# EAGLE design Ebook_Anita_Ghita (EAGLE 9.7.0)
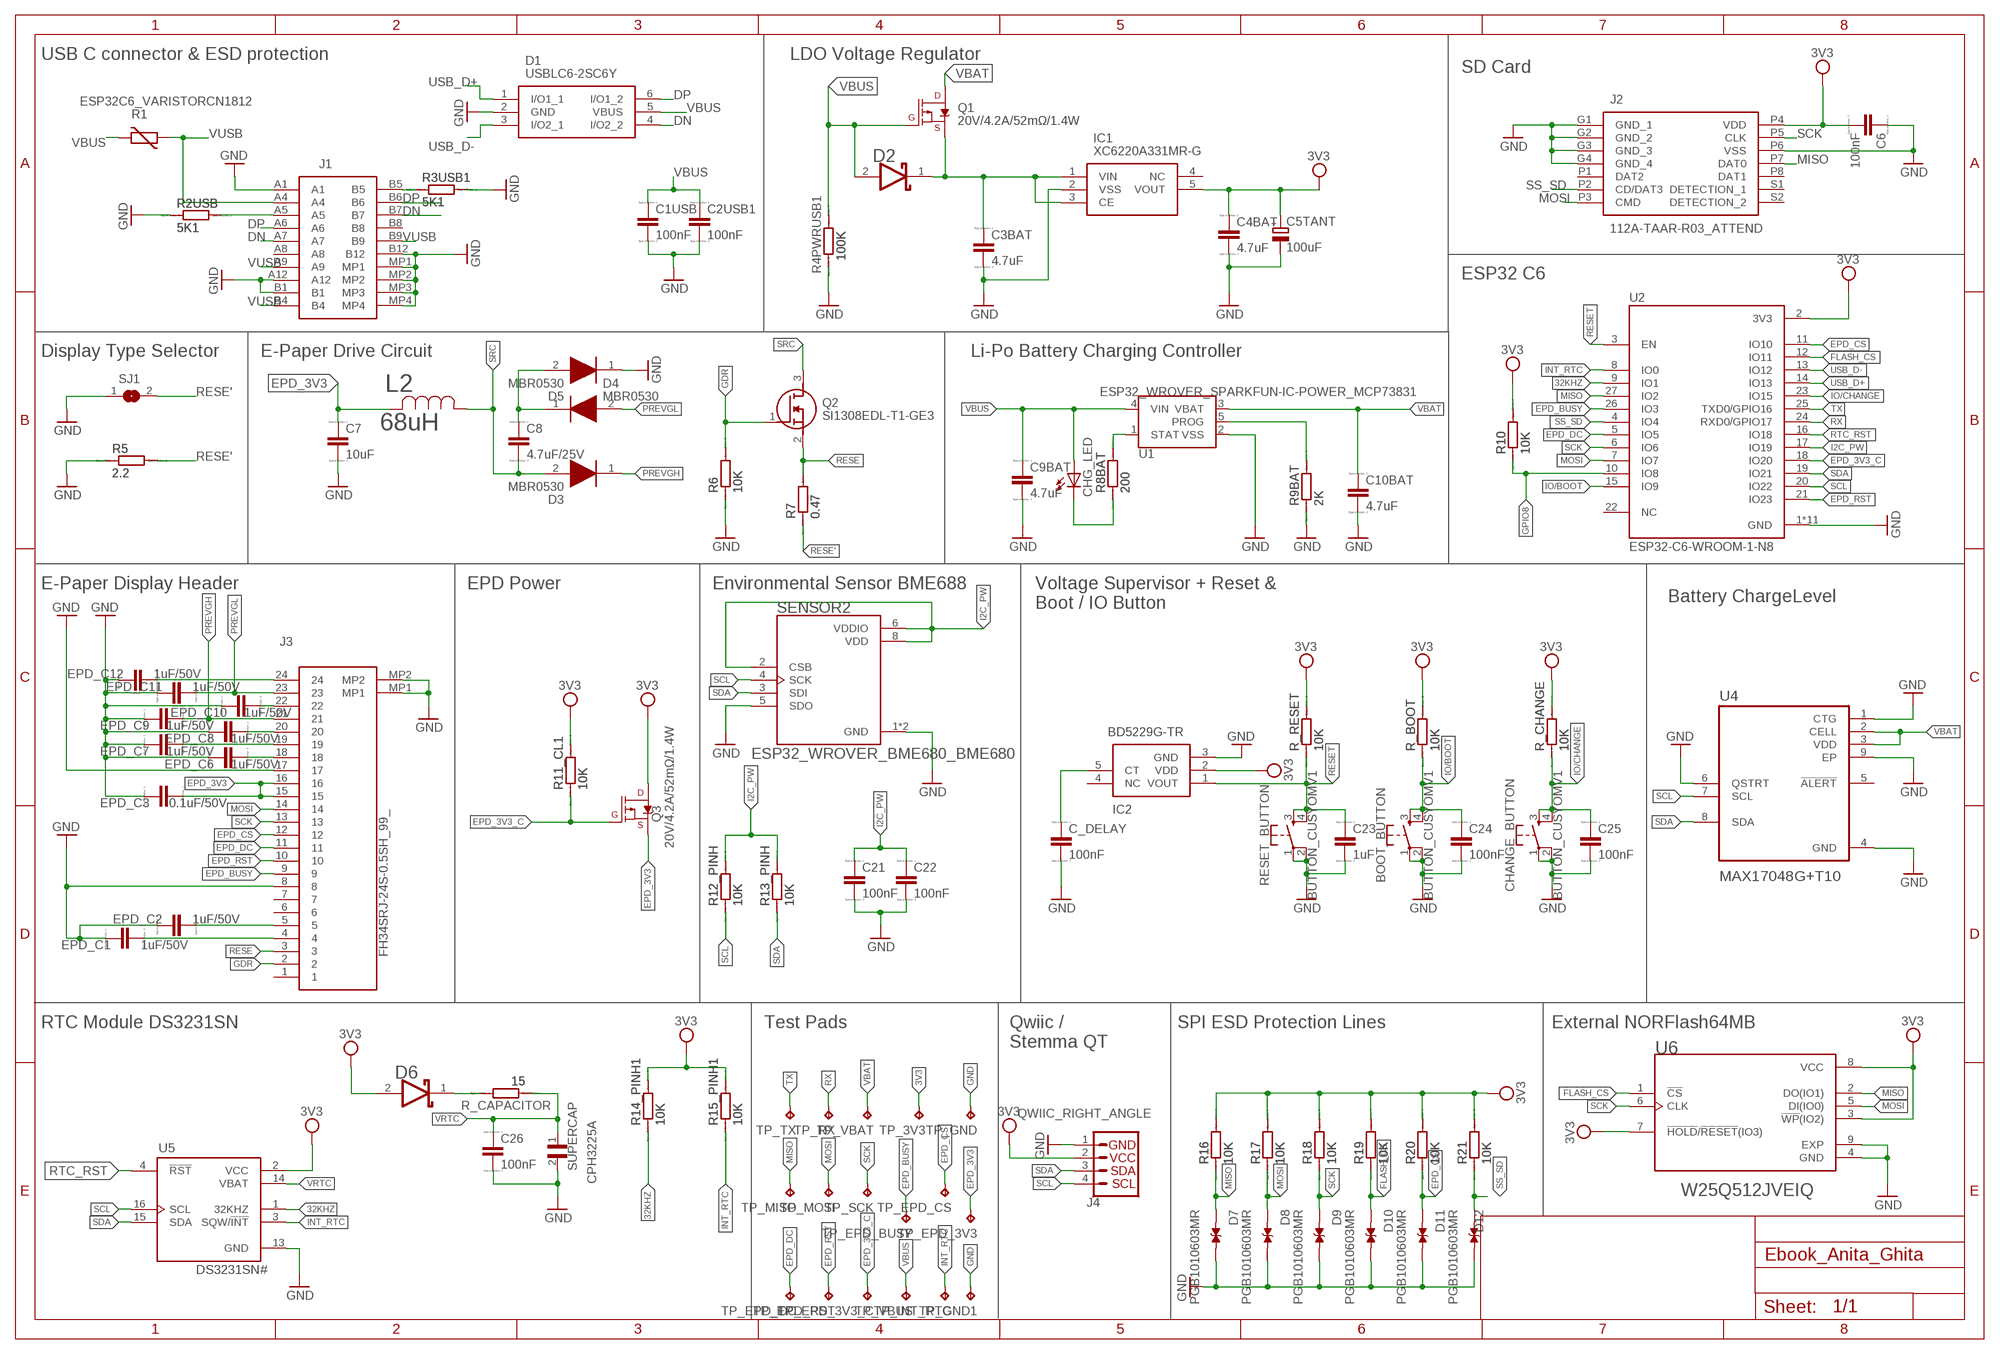
[diagram p0: schematic, sheet 1]

## Parts
BOOT_BUTTON  BUTTON_CUSYOMV1  [MYBUTTON]
C1USB  100nF  EAGLE-LTSPICE_CC0402  [ESP32_WROVER_EAGLE-LTSPICE_C0402]
C2USB1  100nF  EAGLE-LTSPICE_CC0402  [ESP32_WROVER_EAGLE-LTSPICE_C0402]
C3BAT  4.7uF  EAGLE-LTSPICE_CC0402  [ESP32_WROVER_EAGLE-LTSPICE_C0402]
C4BAT  4.7uF  EAGLE-LTSPICE_CC0402  [ESP32_WROVER_EAGLE-LTSPICE_C0402]
C5TANT  100uF  RCL_CPOL-EUCT3528  [RCL_CT3528]
C6  100nF  EAGLE-LTSPICE_CC0402  [ESP32_WROVER_EAGLE-LTSPICE_C0402]
C7  10uF  EAGLE-LTSPICE_CC0402  [ESP32_WROVER_EAGLE-LTSPICE_C0402]
C8  4.7uF/25V  EAGLE-LTSPICE_CC0402  [ESP32_WROVER_EAGLE-LTSPICE_C0402]
C9BAT  4.7uF  EAGLE-LTSPICE_CC0402  [ESP32_WROVER_EAGLE-LTSPICE_C0402]
C10BAT  4.7uF  EAGLE-LTSPICE_CC0402  [ESP32_WROVER_EAGLE-LTSPICE_C0402]
C21  100nF  EAGLE-LTSPICE_CC0402  [ESP32_WROVER_EAGLE-LTSPICE_C0402]
C22  100nF  EAGLE-LTSPICE_CC0402  [ESP32_WROVER_EAGLE-LTSPICE_C0402]
C23  1uF  EAGLE-LTSPICE_CC0402  [ESP32_WROVER_EAGLE-LTSPICE_C0402]
C24  100nF  EAGLE-LTSPICE_CC0402  [ESP32_WROVER_EAGLE-LTSPICE_C0402]
C25  100nF  EAGLE-LTSPICE_CC0402  [ESP32_WROVER_EAGLE-LTSPICE_C0402]
C26  100nF  EAGLE-LTSPICE_CC0402  [ESP32_WROVER_EAGLE-LTSPICE_C0402]
C_DELAY  100nF  EAGLE-LTSPICE_CC0402  [ESP32_WROVER_EAGLE-LTSPICE_C0402]
CHANGE_BUTTON  BUTTON_CUSYOMV1  [MYBUTTON]
CHG_LED  ADAFRUIT_LEDCHIP-LED0603  [ADAFRUIT_CHIP-LED0603]
D1  USBLC6-2SC6Y  [SOT95P280X145-6N]
D2  ESP32_WROVER_AVX---SD0805S020S1R0_AVX_SD0805S020S1R0_0_0AVX_SD0805S020S1R0_0_0  [ESP32_WROVER_AVX---SD0805S020S1R0_AVX_SD0805S020S1R0_0]
D3  MBR0530  [SOD3716X135N]
D4  MBR0530  [SOD3716X135N]
D5  MBR0530  [SOD3716X135N]
D6  ESP32_WROVER_AVX---SD0805S020S1R0_AVX_SD0805S020S1R0_0_0AVX_SD0805S020S1R0_0_0  [ESP32_WROVER_AVX---SD0805S020S1R0_AVX_SD0805S020S1R0_0]
D7  PGB1010603MR  [DIOC1608X36N]
D8  PGB1010603MR  [DIOC1608X36N]
D9  PGB1010603MR  [DIOC1608X36N]
D10  PGB1010603MR  [DIOC1608X36N]
D11  PGB1010603MR  [DIOC1608X36N]
D12  PGB1010603MR  [DIOC1608X36N]
EPD_C1  1uF/50V  EAGLE-LTSPICE_CC0402  [ESP32_WROVER_EAGLE-LTSPICE_C0402]
EPD_C2  1uF/50V  EAGLE-LTSPICE_CC0402  [ESP32_WROVER_EAGLE-LTSPICE_C0402]
EPD_C3  0.1uF/50V  EAGLE-LTSPICE_CC0402  [ESP32_WROVER_EAGLE-LTSPICE_C0402]
EPD_C6  1uF/50V  EAGLE-LTSPICE_CC0402  [ESP32_WROVER_EAGLE-LTSPICE_C0402]
EPD_C7  1uF/50V  EAGLE-LTSPICE_CC0402  [ESP32_WROVER_EAGLE-LTSPICE_C0402]
EPD_C8  1uF/50V  EAGLE-LTSPICE_CC0402  [ESP32_WROVER_EAGLE-LTSPICE_C0402]
EPD_C9  1uF/50V  EAGLE-LTSPICE_CC0402  [ESP32_WROVER_EAGLE-LTSPICE_C0402]
EPD_C10  1uF/50V  EAGLE-LTSPICE_CC0402  [ESP32_WROVER_EAGLE-LTSPICE_C0402]
EPD_C11  1uF/50V  EAGLE-LTSPICE_CC0402  [ESP32_WROVER_EAGLE-LTSPICE_C0402]
EPD_C12  1uF/50V  EAGLE-LTSPICE_CC0402  [ESP32_WROVER_EAGLE-LTSPICE_C0402]
IC1  XC6220A331MR-G  [SOT95P280X120-5N]
IC2  BD5229G-TR  [SOT95P280X125-5N]
J1  SAMACSYS_PARTS_USB4110-GF-A  [SAMACSYS_PARTS_USB4110GFA]
J2  112A-TAAR-R03_ATTEND  [112ATAARR03ATTEND]
J3  FH34SRJ-24S-0.5SH_99_  [FH34SRJ24S05SH99]
J4  QWIIC_RIGHT_ANGLE  QWIIC_CONNECTORJS-1MM  [JST04_1MM_RA]
L2  68uH  744043680IND_4828-WE-TPC_WRE  [IND_4828-WE-TPC_WRE]
Q1  20V/4.2A/52mΩ/1.4W  ESP32_WROVER_SPARKFUN-DISCRETESEMI_MOSFET_PCH-DMG2305UX-7  [ESP32_WROVER_SPARKFUN-DISCRETESEMI_SOT23-3]
Q2  SI1308EDL-T1-GE3  [SOT65P210X110-3N]
Q3  20V/4.2A/52mΩ/1.4W  ESP32_WROVER_SPARKFUN-DISCRETESEMI_MOSFET_PCH-DMG2305UX-7  [ESP32_WROVER_SPARKFUN-DISCRETESEMI_SOT23-3]
R1  ESP32C6_VARISTORCN1812  [ESP32C6_VARISTOR_CT/CN1812]
R2USB  5K1  ESP32_WROVER_EAGLE-LTSPICE_RR0402  [ESP32_WROVER_EAGLE-LTSPICE_R0402]
R3USB1  5K1  ESP32_WROVER_EAGLE-LTSPICE_RR0402  [ESP32_WROVER_EAGLE-LTSPICE_R0402]
R4PWRUSB1  100K  ESP32_WROVER_EAGLE-LTSPICE_RR0402  [ESP32_WROVER_EAGLE-LTSPICE_R0402]
R5  2.2  ESP32_WROVER_EAGLE-LTSPICE_RR0402  [ESP32_WROVER_EAGLE-LTSPICE_R0402]
R6  10K  ESP32_WROVER_EAGLE-LTSPICE_RR0402  [ESP32_WROVER_EAGLE-LTSPICE_R0402]
R7  0.47  ESP32_WROVER_EAGLE-LTSPICE_RR0402  [ESP32_WROVER_EAGLE-LTSPICE_R0402]
R8BAT  200  ESP32_WROVER_EAGLE-LTSPICE_RR0402  [ESP32_WROVER_EAGLE-LTSPICE_R0402]
R9BAT  2K  ESP32_WROVER_EAGLE-LTSPICE_RR0402  [ESP32_WROVER_EAGLE-LTSPICE_R0402]
R10  10K  ESP32_WROVER_EAGLE-LTSPICE_RR0402  [ESP32_WROVER_EAGLE-LTSPICE_R0402]
R11_CL1  10K  ESP32_WROVER_EAGLE-LTSPICE_RR0402  [ESP32_WROVER_EAGLE-LTSPICE_R0402]
R12_PINH  10K  ESP32_WROVER_EAGLE-LTSPICE_RR0402  [ESP32_WROVER_EAGLE-LTSPICE_R0402]
R13_PINH  10K  ESP32_WROVER_EAGLE-LTSPICE_RR0402  [ESP32_WROVER_EAGLE-LTSPICE_R0402]
R14_PINH1  10K  ESP32_WROVER_EAGLE-LTSPICE_RR0402  [ESP32_WROVER_EAGLE-LTSPICE_R0402]
R15_PINH1  10K  ESP32_WROVER_EAGLE-LTSPICE_RR0402  [ESP32_WROVER_EAGLE-LTSPICE_R0402]
R16  10K  ESP32_WROVER_EAGLE-LTSPICE_RR0402  [ESP32_WROVER_EAGLE-LTSPICE_R0402]
R17  10K  ESP32_WROVER_EAGLE-LTSPICE_RR0402  [ESP32_WROVER_EAGLE-LTSPICE_R0402]
R18  10K  ESP32_WROVER_EAGLE-LTSPICE_RR0402  [ESP32_WROVER_EAGLE-LTSPICE_R0402]
R19  10K  ESP32_WROVER_EAGLE-LTSPICE_RR0402  [ESP32_WROVER_EAGLE-LTSPICE_R0402]
R20  10K  ESP32_WROVER_EAGLE-LTSPICE_RR0402  [ESP32_WROVER_EAGLE-LTSPICE_R0402]
R21  10K  ESP32_WROVER_EAGLE-LTSPICE_RR0402  [ESP32_WROVER_EAGLE-LTSPICE_R0402]
R_BOOT  10K  ESP32_WROVER_EAGLE-LTSPICE_RR0402  [ESP32_WROVER_EAGLE-LTSPICE_R0402]
R_CAPACITOR  15  ESP32_WROVER_EAGLE-LTSPICE_RR0402  [ESP32_WROVER_EAGLE-LTSPICE_R0402]
R_CHANGE  10K  ESP32_WROVER_EAGLE-LTSPICE_RR0402  [ESP32_WROVER_EAGLE-LTSPICE_R0402]
R_RESET  10K  ESP32_WROVER_EAGLE-LTSPICE_RR0402  [ESP32_WROVER_EAGLE-LTSPICE_R0402]
RESET_BUTTON  BUTTON_CUSYOMV1  [MYBUTTON]
SENSOR2  ESP32_WROVER_BME680_BME680  [ESP32_WROVER_BME680_PSON80P300X300X100-8N]
SJ1  SJ  [SJ]
SUPERCAP  CPH3225A  [CAPCP3225X100N]
TP_3V3  TPTP20R  [TP20R]
TP_EPD_3V3  TPTP20R  [TP20R]
TP_EPD_3V3_C  TPTP20R  [TP20R]
TP_EPD_BUSY  TPTP20R  [TP20R]
TP_EPD_CS  TPTP20R  [TP20R]
TP_EPD_DC  TPTP20R  [TP20R]
TP_EPD_RST  TPTP20R  [TP20R]
TP_GND  TPTP20R  [TP20R]
TP_GND1  TPTP20R  [TP20R]
TP_INT_RTC  TPTP20R  [TP20R]
TP_MISO  TPTP20R  [TP20R]
TP_MOSI  TPTP20R  [TP20R]
TP_RX  TPTP20R  [TP20R]
TP_SCK  TPTP20R  [TP20R]
TP_TX  TPTP20R  [TP20R]
TP_VBAT  TPTP20R  [TP20R]
TP_VBUS  TPTP20R  [TP20R]
U1  ESP32_WROVER_SPARKFUN-IC-POWER_MCP73831  [ESP32_WROVER_SPARKFUN-IC-POWER_SOT23-5]
U2  ESP32-C6-WROOM-1-N8  [XCVR_ESP32-C6-WROOM-1-N8]
U4  MAX17048G+T10  [SON50P200X200X80-9N]
U5  DS3231SN#  [SOIC127P1032X265-16N]
U6  W25Q512JVEIQ  [SON127P600X800X80-9N]

## Nets
3V3: C4BAT.1 C5TANT.+ C6.2 D6.2(ANODE) IC1.5(VOUT) IC2.2(VDD) J2.P4(VDD) J4.2 Q3.3(D) R10.2 R11_CL1.2 R14_PINH1.2 R15_PINH1.2 R16.2 R17.2 R18.2 R19.2 R20.2 R21.2 R_BOOT.2 R_CHANGE.2 R_RESET.2 TP_3V3.TP U2.2(3V3) U5.2(VCC) U6.3(!WP!(IO2)) U6.7(!HOLD!/!RESET!(IO3)) U6.8(VCC)
32KHZ: R14_PINH1.1 U2.9(IO1) U5.1(32KHZ)
DN: D1.4(I/O2_2) J1.A7 J1.B7
DP: D1.6(I/O1_2) J1.A6 J1.B6
EPD_3V3: C7.1 EPD_C3.2 J3.15 J3.16 L2.2 Q3.2(S) TP_EPD_3V3.TP
EPD_3V3_C: Q3.1(G) R11_CL1.1 TP_EPD_3V3_C.TP U2.18(IO20)
EPD_BUSY: J3.9 TP_EPD_BUSY.TP U2.26(IO3)
EPD_CS: D11.1 J3.12 R20.1 TP_EPD_CS.TP U2.11(IO10)
EPD_DC: J3.11 TP_EPD_DC.TP U2.5(IO5)
EPD_RST: J3.10 TP_EPD_RST.TP U2.21(IO23)
FLASH_CS: D10.1 R19.1 U2.12(IO11) U6.1(!CS)
GDR: J3.2 Q2.1(G) R6.2
GND: BOOT_BUTTON.1 BOOT_BUTTON.2 C1USB.2 C2USB1.2 C3BAT.2 C4BAT.2 C5TANT.- C6.1 C7.2 C9BAT.2 C10BAT.2 C21.2 C22.2 C23.2 C24.2 C25.2 C26.2 C_DELAY.2 CHANGE_BUTTON.1 CHANGE_BUTTON.2 D1.2(GND) D5.1(K) D7.2 D8.2 D9.2 D10.2 D11.2 D12.2 EPD_C1.1 EPD_C2.1 EPD_C3.1 EPD_C6.1 EPD_C7.1 EPD_C8.1 EPD_C9.1 EPD_C10.1 EPD_C11.1 EPD_C12.1 IC1.2(VSS) IC2.3(GND) J1.A1 J1.A12 J1.B1 J1.B12 J1.MP1 J1.MP2 J1.MP3 J1.MP4 J2.G1(GND_1) J2.G2(GND_2) J2.G3(GND_3) J2.G4(GND_4) J2.P6(VSS) J3.8 J3.17 J3.MP1 J3.MP2 J4.1 R2USB.1 R3USB1.2 R4PWRUSB1.1 R5.1 R6.1 R9BAT.1 RESET_BUTTON.1 RESET_BUTTON.2 SENSOR2.1(GND) SENSOR2.5(SDO) SENSOR2.7(GND) SJ1.1 SUPERCAP.2 TP_GND1.TP TP_GND.TP U1.2(VSS) U2.1(GND) U2.28(GND) U2.29_1(GND) U2.29_2(GND) U2.29_3(GND) U2.29_4(GND) U2.29_5(GND) U2.29_6(GND) U2.29_7(GND) U2.29_8(GND) U2.29_9(GND) U4.1(CTG) U4.4(GND) U4.6(QSTRT) U4.9(EP) U5.13(GND) U6.4(GND) U6.9(EXP)
GPIO8: R10.1 U2.10(IO8)
I2C_PW: C21.1 C22.1 R12_PINH.2 R13_PINH.2 SENSOR2.2(CSB) SENSOR2.6(VDDIO) SENSOR2.8(VDD) U2.17(IO19)
INT_RTC: R15_PINH1.1 TP_INT_RTC.TP U2.8(IO0) U5.3(SQW/!INT)
IO/BOOT: BOOT_BUTTON.3 BOOT_BUTTON.4 C24.1 R_BOOT.1 U2.15(IO9)
IO/CHANGE: C25.1 CHANGE_BUTTON.3 CHANGE_BUTTON.4 R_CHANGE.1 U2.23(IO15)
MISO: D7.1 J2.P7(DAT0) R16.1 TP_MISO.TP U2.27(IO2) U6.2(DO(IO1))
MOSI: D8.1 J2.P3(CMD) J3.14 R17.1 TP_MOSI.TP U2.7(IO7) U6.5(DI(IO0))
N$1: J1.A5 R2USB.2
N$2: EPD_C6.2 J3.18
N$3: EPD_C1.2 J3.4
N$4: C3BAT.1 D2.1(CATHODE) IC1.1(VIN) IC1.3(CE) Q1.2(S)
N$5: C8.1 D4.1(K) D5.2(A)
N$6: R8BAT.2 U1.1(STAT)
N$7: CHG_LED.C R8BAT.1
N$8: R9BAT.2 U1.5(PROG)
N$9: EPD_C2.2 J3.5
N$10: J1.B5 R3USB1.1
N$11: EPD_C7.2 J3.19
N$12: EPD_C8.2 J3.20
N$13: C_DELAY.1 IC2.5(CT)
N$14: EPD_C10.2 J3.22
N$15: D6.1(CATHODE) R_CAPACITOR.2
N$16: EPD_C12.2 J3.24
PREVGH: D3.1(K) EPD_C9.2 J3.21
PREVGL: D4.2(A) EPD_C11.2 J3.23
RESE: J3.3 Q2.2(S) R7.2
RESE': R5.2 R7.1 SJ1.2
RESET: C23.1 IC2.1(VOUT) R_RESET.1 RESET_BUTTON.3 RESET_BUTTON.4 U2.3(EN)
RTC_RST: U2.16(IO18) U5.4(!RST)
RX: TP_RX.TP U2.24(RXD0/GPIO17)
SCK: D9.1 J2.P5(CLK) J3.13 R18.1 TP_SCK.TP U2.6(IO6) U6.6(CLK)
SCL: J4.4 R12_PINH.1 SENSOR2.4(SCK) U2.20(IO22) U4.7(SCL) U5.16(SCL)
SDA: J4.3 R13_PINH.1 SENSOR2.3(SDI) U2.19(IO21) U4.8(SDA) U5.15(SDA)
SRC: C8.2 D3.2(A) L2.1 Q2.3(D)
SS_SD: D12.1 J2.P2(CD/DAT3) R21.1 U2.4(IO4)
TX: TP_TX.TP U2.25(TXD0/GPIO16)
USB_D+: D1.1(I/O1_1) U2.14(IO13)
USB_D-: D1.3(I/O2_1) U2.13(IO12)
VBAT: C10BAT.1 Q1.3(D) TP_VBAT.TP U1.3(VBAT) U4.2(CELL) U4.3(VDD)
VBUS: C1USB.1 C2USB1.1 C9BAT.1 CHG_LED.A D1.5(VBUS) D2.2(ANODE) Q1.1(G) R1.2 R4PWRUSB1.2 TP_VBUS.TP U1.4(VIN)
VRTC: C26.1 R_CAPACITOR.1 SUPERCAP.1 U5.14(VBAT)
VUSB: J1.A4 J1.A9 J1.B4 J1.B9 R1.1
Unconnected: IC1.4(NC) IC2.4(NC) J1.A8 J1.B8 J2.P1(DAT2) J2.P8(DAT1) J2.S1(DETECTION_1) J2.S2(DETECTION_2) J3.1 J3.6 J3.7 U2.22(NC) U4.5(!ALERT)

## Notes on the sheet
- USB C connector & ESD protection | LDO Voltage Regulator
- SD Card
- ESP32 C6
- Display Type Selector | E-Paper Drive Circuit | Li-Po Battery Charging Controller
- E-Paper Display Header | EPD Power | Environmental Sensor BME688
- Voltage Supervisor + Reset &
  Boot / IO Button
- Battery ChargeLevel
- RTC Module DS3231SN | Test Pads
- Qwiic /
  Stemma QT
- SPI ESD Protection Lines | External NORFlash64MB

## Library data of the parts
BOOT_BUTTON CHANGE_BUTTON RESET_BUTTON = DeskAssistant v19 v1:BUTTON_CUSYOMV1
C1USB C2USB1 C3BAT C4BAT C6-C8 C9BAT C10BAT C21-C26 C_DELAY EPD_C1-EPD_C3 EPD_C6-EPD_C12 = DeskAssistant v19 v1:EAGLE-LTSPICE_C: CAPACITOR, European symbol; SPICEMODEL: NONE; SPICEPREFIX: C
C5TANT = DeskAssistant v19 v1:RCL_CPOL-EU: POLARIZED CAPACITOR, European symbol; SPICEPREFIX: C
CHG_LED = DeskAssistant v19 v1:ADAFRUIT_LED: LED OSRAM: - CHIPLED LG R971, LG N971, LY N971, LG Q971, LY Q971, LO R971, LY R971 LH N974, LH R974 LS Q976, LO Q976, LY Q976 LO Q996 - Hyper CHIPLED LW Q18S LB Q993, LB Q99A, LB R99A - SideLED LS A670, LO A670, LY A670, LG A670, LP A670 LB A673, LV A673, LT A673, LW A673 LH A674 LY A675 LS A676, LA A676, LO A676, LY A676, LW A676 LS A679, LY A679, LG A679 - Hyper Micro SIDELED® LS Y876, LA Y876, LO Y876, LY Y876 LT Y87S - SmartLED LW L88C, LW L88S LB L89C, LB L89S, LG L890 LS L89K, LO L89K, LY L89K LS L896, LA L896, LO L896, LY L896 - TOPLED LS T670, LO T670, LY T670, LG T670, LP T670 LSG T670, LSP T670, LSY T670, LOP T670, LYG T670 LG T671, LOG T671, LSG T671 LB T673, LV T673, LT T673, LW T673 LH T674 LS T676, LA T676, LO T676, LY T676, LB T676, LH T676, LSB T676, LW T676 LB T67C, LV T67C, LT T67C, LS T67K, LO T67K, LY T67K, LW E67C LS E67B, LA E67B, LO E67B, LY E67B, LB E67C, LV E67C, LT E67C LW T67C LS T679, LY T679, LG T679 LS T770, LO T770, LY T770, LG T770, LP T770 LB T773, LV T773, LT T773, LW T773 LH T774 LS E675, LA E675, LY E675, LS T675 LS T776, LA T776, LO T776, LY T776, LB T776 LHGB T686 LT T68C, LB T68C - Hyper Mini TOPLED® LB M676 - Mini TOPLED Santana® LG M470 LS M47K, LO M47K, LY M47K Source: http://www.osram.convergy.de/
D1 = DeskAssistant v19 v1:USBLC6-2SC6Y: Low Cap. ESD Protection Auto SOT-23-6 STMicroelectronics USBLC6-2SC6Y, Dual Uni-Directional TVS Diode Array, 6-Pin SOT-23 Source: Datasheet <https://componentsearchengine.com/Datasheets/1/USBLC6-2SC6Y.pdf> Check availability <https://pricing.snapeda.com/parts/USBLC6-2SC6Y/STMicroelectronics/view-part?ref=eda>; AVAILABILITY: In Stock; CHECK_PRICES: https://www.snapeda.com/parts/USBLC6-2SC6Y/STMicroelectronics/view-part/?ref=eda; DESCRIPTION: 17V Clamp 5A (8/20µs) Ipp Tvs Diode Surface Mount SOT-23-6; MF: STMicroelectronics; MP: USBLC6-2SC6Y; PACKAGE: SOT-23-6 STMicroelectronics; PRICE: None; SNAPEDA_LINK: https://www.snapeda.com/parts/USBLC6-2SC6Y/STMicroelectronics/view-part/?ref=snap
D2 D6 = DeskAssistant v19 v1:ESP32_WROVER_AVX---SD0805S020S1R0_AVX_SD0805S020S1R0_0_0: Schottky Barrier Rectifier Diode; CENTROID_NOT_SPECIFIED: No; DATASHEET: http://datasheets.avx.com/schottky.pdf; DIGIKEY_DESCRIPTION: DIODE SCHOTTKY 20V 1A 0805; DIGIKEY_PART_NUMBER: 478-7800-1-ND; LEAD_FREE: yes; MF: AVX; MOUSER_PART_NUMBER: 581-SD0805S020S1R0; PACKAGE: 0805 (2012 metric); PREFIX: D; ROHS: yes; TEMPERATURE_RANGE_HIGH: +125°C; TEMPERATURE_RANGE_LOW: -55°C
D3-D5 = DeskAssistant v19 v1:MBR0530: ON SEMICONDUCTOR - MBR0530 - DIODE, SCHOTTKY, 0.5A, 30V, SOD-123 Source: Datasheet <http://www.onsemi.com/pub/Collateral/MBR0530T1-D.PDF> Check availability <https://pricing.snapeda.com/parts/MBR0530/ON%20Semiconductor/view-part?ref=eda>; AVAILABILITY: In Stock; CHECK_PRICES: https://www.snapeda.com/parts/MBR0530/Onsemi/view-part/?ref=eda; DESCRIPTION: Diode Schottky 30 V 500mA Surface Mount SOD-123; MF: ON Semiconductor; MP: MBR0530; PACKAGE: SOD-123-2 ON Semiconductor; PRICE: None; PURCHASE-URL: https://www.snapeda.com/api/url_track_click_mouser/?unipart_id=179458&manufacturer=ON Semiconductor&part_name=MBR0530&search_term=None; SNAPEDA_LINK: https://www.snapeda.com/parts/MBR0530/Onsemi/view-part/?ref=snap
D7-D12 = DeskAssistant v19 v1:PGB1010603MR: Check availability <https://pricing.snapeda.com/parts/PGB1010603MR/Littelfuse%20Inc./view-part?ref=eda>; AVAILABILITY: In Stock; CHECK_PRICES: https://www.snapeda.com/parts/PGB1010603MR/Littelfuse/view-part/?ref=eda; DESCRIPTION: 150V (Typ) Clamp - Ipp Tvs Diode Surface Mount 0603 (1608 Metric); MF: Littelfuse Inc.; MP: PGB1010603MR; PACKAGE: 0603 Littelfuse Inc.; PRICE: None; PURCHASE-URL: https://www.snapeda.com/api/url_track_click_mouser/?unipart_id=5659453&manufacturer=Littelfuse Inc.&part_name=PGB1010603MR&search_term=None; SNAPEDA_LINK: https://www.snapeda.com/parts/PGB1010603MR/Littelfuse/view-part/?ref=snap
IC1 = DeskAssistant v19 v1:XC6220A331MR-G: LDO Voltage Regulators Source: Datasheet <https://www.torexsemi.com/file/xc6220/XC6220.pdf>; DESCRIPTION: LDO Voltage Regulators; HEIGHT: 1.2mm; MANUFACTURER_NAME: Torex; MANUFACTURER_PART_NUMBER: XC6220A331MR-G; MOUSER_PART_NUMBER: 865-XC6220A331MR-G; MOUSER_PRICE-STOCK: https://www.mouser.co.uk/ProductDetail/Torex-Semiconductor/XC6220A331MR-G?qs=AsjdqWjXhJ8ZSWznL1J0gg%3D%3D
IC2 = DeskAssistant v19 v1:BD5229G-TR: Voltage Detector with Adjustable Delay Time: CMOS processes are utilized to develop high precision, low current consumption CMOS reset ICs that allow arbitrary setting of the delay time. The extensive lineup includes both Nch Open Drain and CMOS output types in a wide range of detection voltages (from 2.3V to 6.0V, in 0.1V steps), enabling selection of the ideal solution based on customer requirements. In addition, the entire series is of course both lead-free and RoHS-compliant. Source: Datasheet <https://datasheet.datasheetarchive.com/originals/distributors/Datasheets_SAMA/f2b9741ef86007909f138d561a359946.pdf>; DESCRIPTION: Voltage Detector with Adjustable Delay Time: CMOS processes are utilized to develop high precision, low current consumption CMOS reset ICs that allow arbitrary setting of the delay time. The extensive lineup includes both Nch Open Drain and CMOS output types in a wide range of detection voltages (from 2.3V to 6.0V, in 0.1V steps), enabling selection of the ideal solution based on customer requirements. In addition, the entire series is of course both lead-free and RoHS-compliant.; HEIGHT: 1.25mm; MANUFACTURER_NAME: ROHM Semiconductor; MANUFACTURER_PART_NUMBER: BD5229G-TR; MOUSER_PART_NUMBER: 755-BD5229G-TR; MOUSER_PRICE-STOCK: https://www.mouser.co.uk/ProductDetail/ROHM-Semiconductor/BD5229G-TR?qs=4kLU8WoGk0vvnhrrYwdszw%3D%3D
J1 = DeskAssistant v19 v1:SAMACSYS_PARTS_USB4110-GF-A: CONN USB 2.0 TYPE-C R/A SMT Source: Datasheet <https://gct.co/files/drawings/usb4110.pdf>; DESCRIPTION: CONN USB 2.0 TYPE-C R/A SMT; HEIGHT: 3.26mm; MANUFACTURER_NAME: GCT (GLOBAL CONNECTOR TECHNOLOGY); MANUFACTURER_PART_NUMBER: USB4110-GF-A; MOUSER_PART_NUMBER: 640-USB4110-GF-A; MOUSER_PRICE-STOCK: https://www.mouser.co.uk/ProductDetail/GCT/USB4110-GF-A?qs=KUoIvG%2F9IlYiZvIXQjyJeA%3D%3D
J2 = DeskAssistant v19 v1:112A-TAAR-R03_ATTEND: Micro SD Card Socket, Push-Push Type, Top Mount, SMT, H=1.83mm, 10u Source: Datasheet <https://www.attend.com.tw/data/download/file/112A-TAAR-R03.pdf>; DESCRIPTION: Micro SD Card Socket, Push-Push Type, Top Mount, SMT, H=1.83mm, 10u; HEIGHT: 1.9mm; MANUFACTURER_NAME: ATTEND; MANUFACTURER_PART_NUMBER: 112A-TAAR-R03 ATTEND
J3 = DeskAssistant v19 v1:FH34SRJ-24S-0.5SH_99_: 24 Position FFC, FPC Connector Contacts, Top and Bottom 0.020" (0.50mm) Surface Mount, Right Angle Source: Datasheet <https://www.hirose.com/en/product/document?clcode=CL0580-1255-6-99&productname=FH34SRJ-24S-0.5SH(99)&series=FH34SRJ&documenttype=2DDrawing&lang=en&documentid=0000990903>; DESCRIPTION: 24 Position FFC, FPC Connector Contacts, Top and Bottom 0.020" (0.50mm) Surface Mount, Right Angle; HEIGHT: 1.1mm; MANUFACTURER_NAME: Hirose; MANUFACTURER_PART_NUMBER: FH34SRJ-24S-0.5SH(99); MOUSER_PART_NUMBER: 798-FH34SRJ24S05SH99; MOUSER_PRICE-STOCK: https://www.mouser.co.uk/ProductDetail/Hirose-Connector/FH34SRJ-24S-0.5SH99?qs=vcbW%252B4%252BSTIpKBl5ap9J8Fw%3D%3D
J4 = DeskAssistant v19 v1:QWIIC_CONNECTOR: SparkFun I2C Standard Qwiic Connector An SMD 1mm pitch JST connector makes it easy and quick (get it? Qwiic?) to connect I2C devices to each other. The Qwiic system <http://www.sparkfun.com/qwiic> enables fast and solderless connection between popular platforms and various sensors and actuators. We carry 200mm <https://www.sparkfun.com/products/14204>, 100mm <https://www.sparkfun.com/products/14205>, 50mm <https://www.sparkfun.com/products/14206>, and breadboard friendly <https://www.sparkfun.com/products/14207> Qwiic cables. We also offer 10 pcs strips <https://www.sparkfun.com/products/14323> the SMD connectors.; PROD_ID: CONN-13694
L2 = DeskAssistant v19 v1:744043680; COPYRIGHT: Copyright (C) 2024 Ultra Librarian. All rights reserved.; MANUFACTURER_PART_NUMBER: 744043680; MFR_NAME: Wurth Electronics
Q1 Q3 = DeskAssistant v19 v1:ESP32_WROVER_SPARKFUN-DISCRETESEMI_MOSFET_PCH: P-channel MOSFETs Voltage controlled devices that allow control of high current outputs. SparkFun Products: SparkFun ESP32 Thing <https://www.sparkfun.com/products/13907> SparkFun ESP8266 Thing <https://www.sparkfun.com/products/13231> SparkFun Pi Servo HAT V2 <https://www.sparkfun.com/products/15316> DMG2305UX-7 (20V/4.2A/SOT23-3); PROD_ID: TRAN-14388
Q2 = DeskAssistant v19 v1:SI1308EDL-T1-GE3: MOSFET N-Ch 30V 1.5A TrenchFET SC70 Vishay Si1308EDL-T1-GE3 N-channel MOSFET Transistor, 1.5 A, 30 V, 3-Pin SC-70 Source: Datasheet <https://componentsearchengine.com/Datasheets/1/SI1308EDL-T1-GE3.pdf> Check availability <https://pricing.snapeda.com/parts/SI1308EDL-T1-GE3/Vishay%20Siliconix/view-part?ref=eda>; AVAILABILITY: In Stock; CHECK_PRICES: https://www.snapeda.com/parts/SI1308EDL-T1-GE3/Vishay+Siliconix/view-part/?ref=eda; DESCRIPTION: Si1308EDL-T1-GE3 N-channel MOSFET Transistor, 1.5 A, 30 V, 3-Pin SC-70 | Siliconix / Vishay SI1308EDL-T1-GE3; MF: Vishay Siliconix; MP: SI1308EDL-T1-GE3; PACKAGE: SOT-323 Vishay Semiconductor; PRICE: None; PURCHASE-URL: https://www.snapeda.com/api/url_track_click_mouser/?unipart_id=274603&manufacturer=Vishay Siliconix&part_name=SI1308EDL-T1-GE3&search_term=None; SNAPEDA_LINK: https://www.snapeda.com/parts/SI1308EDL-T1-GE3/Vishay+Siliconix/view-part/?ref=snap
R1 = DeskAssistant v19 v1:ESP32C6_VARISTOR: VARISTOR
R2USB R3USB1 R4PWRUSB1 R5-R7 R8BAT R9BAT R10 R11_CL1 R12_PINH R13_PINH R14_PINH1 R15_PINH1 R16-R21 R_BOOT R_CAPACITOR R_CHANGE R_RESET = DeskAssistant v19 v1:ESP32_WROVER_EAGLE-LTSPICE_R: RESISTOR, European symbol; SPICEMODEL: NONE; SPICEPREFIX: R
SENSOR2 = DeskAssistant v19 v1:ESP32_WROVER_BME680_BME680: Integrated Environmental Unit; AVAILABILITY: Unavailable; DESCRIPTION: Integrated Environmental Unit; MF: Bosch Sensortec; MP: BME680; PACKAGE: LGA-8 Bosch Tools; PRICE: None
SJ1 = DeskAssistant v19 v1:SJ: SMD solder JUMPER
SUPERCAP = DeskAssistant v19 v1:CPH3225A: Cap 0.011F 3.3V 1210 Flat Check availability <https://pricing.snapeda.com/parts/CPH3225A/Seiko%20Instruments/view-part?ref=eda>; AVAILABILITY: Not in stock; CHECK_PRICES: https://www.snapeda.com/parts/CPH3225A/Seiko+Instruments/view-part/?ref=eda; DESCRIPTION: 11 mF (EDLC) Supercapacitor 3.3 V 1210 (3225 Metric) - -; MF: Seiko Instruments; MP: CPH3225A; PACKAGE: 1210 Seiko; PRICE: None; PURCHASE-URL: https://www.snapeda.com/api/url_track_click_mouser/?unipart_id=562593&manufacturer=Seiko Instruments&part_name=CPH3225A&search_term=None; SNAPEDA_LINK: https://www.snapeda.com/parts/CPH3225A/Seiko+Instruments/view-part/?ref=snap
TP_3V3 TP_EPD_3V3 TP_EPD_3V3_C TP_EPD_BUSY TP_EPD_CS TP_EPD_DC TP_EPD_RST TP_GND TP_GND1 TP_INT_RTC TP_MISO TP_MOSI TP_RX TP_SCK TP_TX TP_VBAT TP_VBUS = DeskAssistant v19 v1:TP: Test pad
U1 = DeskAssistant v19 v1:ESP32_WROVER_SPARKFUN-IC-POWER_MCP73831: MCP73831T Li-Ion, Li-Pol Controller Miniature single cell, fully integrated Li-Ion, Li-polymer charge management controller Datasheet <http://ww1.microchip.com/downloads/en/DeviceDoc/20001984g.pdf> SparkFun Products: SparkFun ESP32 Thing <https://www.sparkfun.com/products/13907> SparkFun 9DoF Razor IMU M0 <https://www.sparkfun.com/products/14001>; PROD_ID: IC-09995
U2 = DeskAssistant v19 v1:ESP32-C6-WROOM-1-N8: Check availability <https://pricing.snapeda.com/parts/ESP32-C6-WROOM-1-N8/Espressif%20Systems/view-part?ref=eda>; AVAILABILITY: In Stock; CHECK_PRICES: https://www.snapeda.com/parts/ESP32-C6-WROOM-1-N8/Espressif+Systems/view-part/?ref=eda; DESCRIPTION: Multiprotocol Modules ESP32-C6 module, Wi-Fi 6 in 2.4 GHz band, Bluetooth 5, Zigbee 3.0 and Thread. ESP34-WROOM Compatible - ENGINEERING SAMPLE; MF: Espressif Systems; MP: ESP32-C6-WROOM-1-N8; PACKAGE: None; PRICE: None; SNAPEDA_LINK: https://www.snapeda.com/parts/ESP32-C6-WROOM-1-N8/Espressif+Systems/view-part/?ref=snap
U4 = DeskAssistant v19 v1:MAX17048G+T10: Check availability <https://pricing.snapeda.com/parts/MAX17048G%2BT10/Analog%20Devices/view-part?ref=eda>; AVAILABILITY: In Stock; CHECK_PRICES: https://www.snapeda.com/parts/MAX17048G+T10/Analog+Devices/view-part/?ref=eda; DESCRIPTION: 3µA 1-Cell/2-Cell Fuel Gauge with ModelGauge; MF: Analog Devices; MP: MAX17048G+T10; PACKAGE: TDFN-8 Maxim; PRICE: None; PURCHASE-URL: https://www.snapeda.com/api/url_track_click_mouser/?unipart_id=329239&manufacturer=Analog Devices&part_name=MAX17048G+T10&search_term=None; SNAPEDA_LINK: https://www.snapeda.com/parts/MAX17048G+T10/Analog+Devices/view-part/?ref=snap
U5 = DeskAssistant v19 v1:DS3231SN#: Real Time Clock Serial 16-Pin SOIC W T/R Check availability <https://pricing.snapeda.com/parts/DS3231SN%23/Analog%20Devices/view-part?ref=eda>; AVAILABILITY: In Stock; CHECK_PRICES: https://www.snapeda.com/parts/DS3231SN%23/Analog+Devices/view-part/?ref=eda; DESCRIPTION: Extremely Accurate I²C-Integrated RTC/TCXO/Crystal; MF: Analog Devices; MP: DS3231SN#; PACKAGE: SOIC-16 Maxim; PRICE: None; PURCHASE-URL: https://www.snapeda.com/api/url_track_click_mouser/?unipart_id=99048&manufacturer=Analog Devices&part_name=DS3231SN#&search_term=None; SNAPEDA_LINK: https://www.snapeda.com/parts/DS3231SN%23/Analog+Devices/view-part/?ref=snap
U6 = DeskAssistant v19 v1:W25Q512JVEIQ: Check availability <https://pricing.snapeda.com/parts/W25Q512JVEIQ/Winbond%20Electronics/view-part?ref=eda>; AVAILABILITY: In Stock; CHECK_PRICES: https://www.snapeda.com/parts/W25Q512JVEIQ/Winbond+Electronics/view-part/?ref=eda; DESCRIPTION: FLASH - NOR Memory IC 512Mb (64M x 8) SPI - Quad I/O 133 MHz 8-WSON (8x6); MF: Winbond Electronics; MP: W25Q512JVEIQ; PACKAGE: Package; PRICE: None; SNAPEDA_LINK: https://www.snapeda.com/parts/W25Q512JVEIQ/Winbond+Electronics/view-part/?ref=snap

## Board
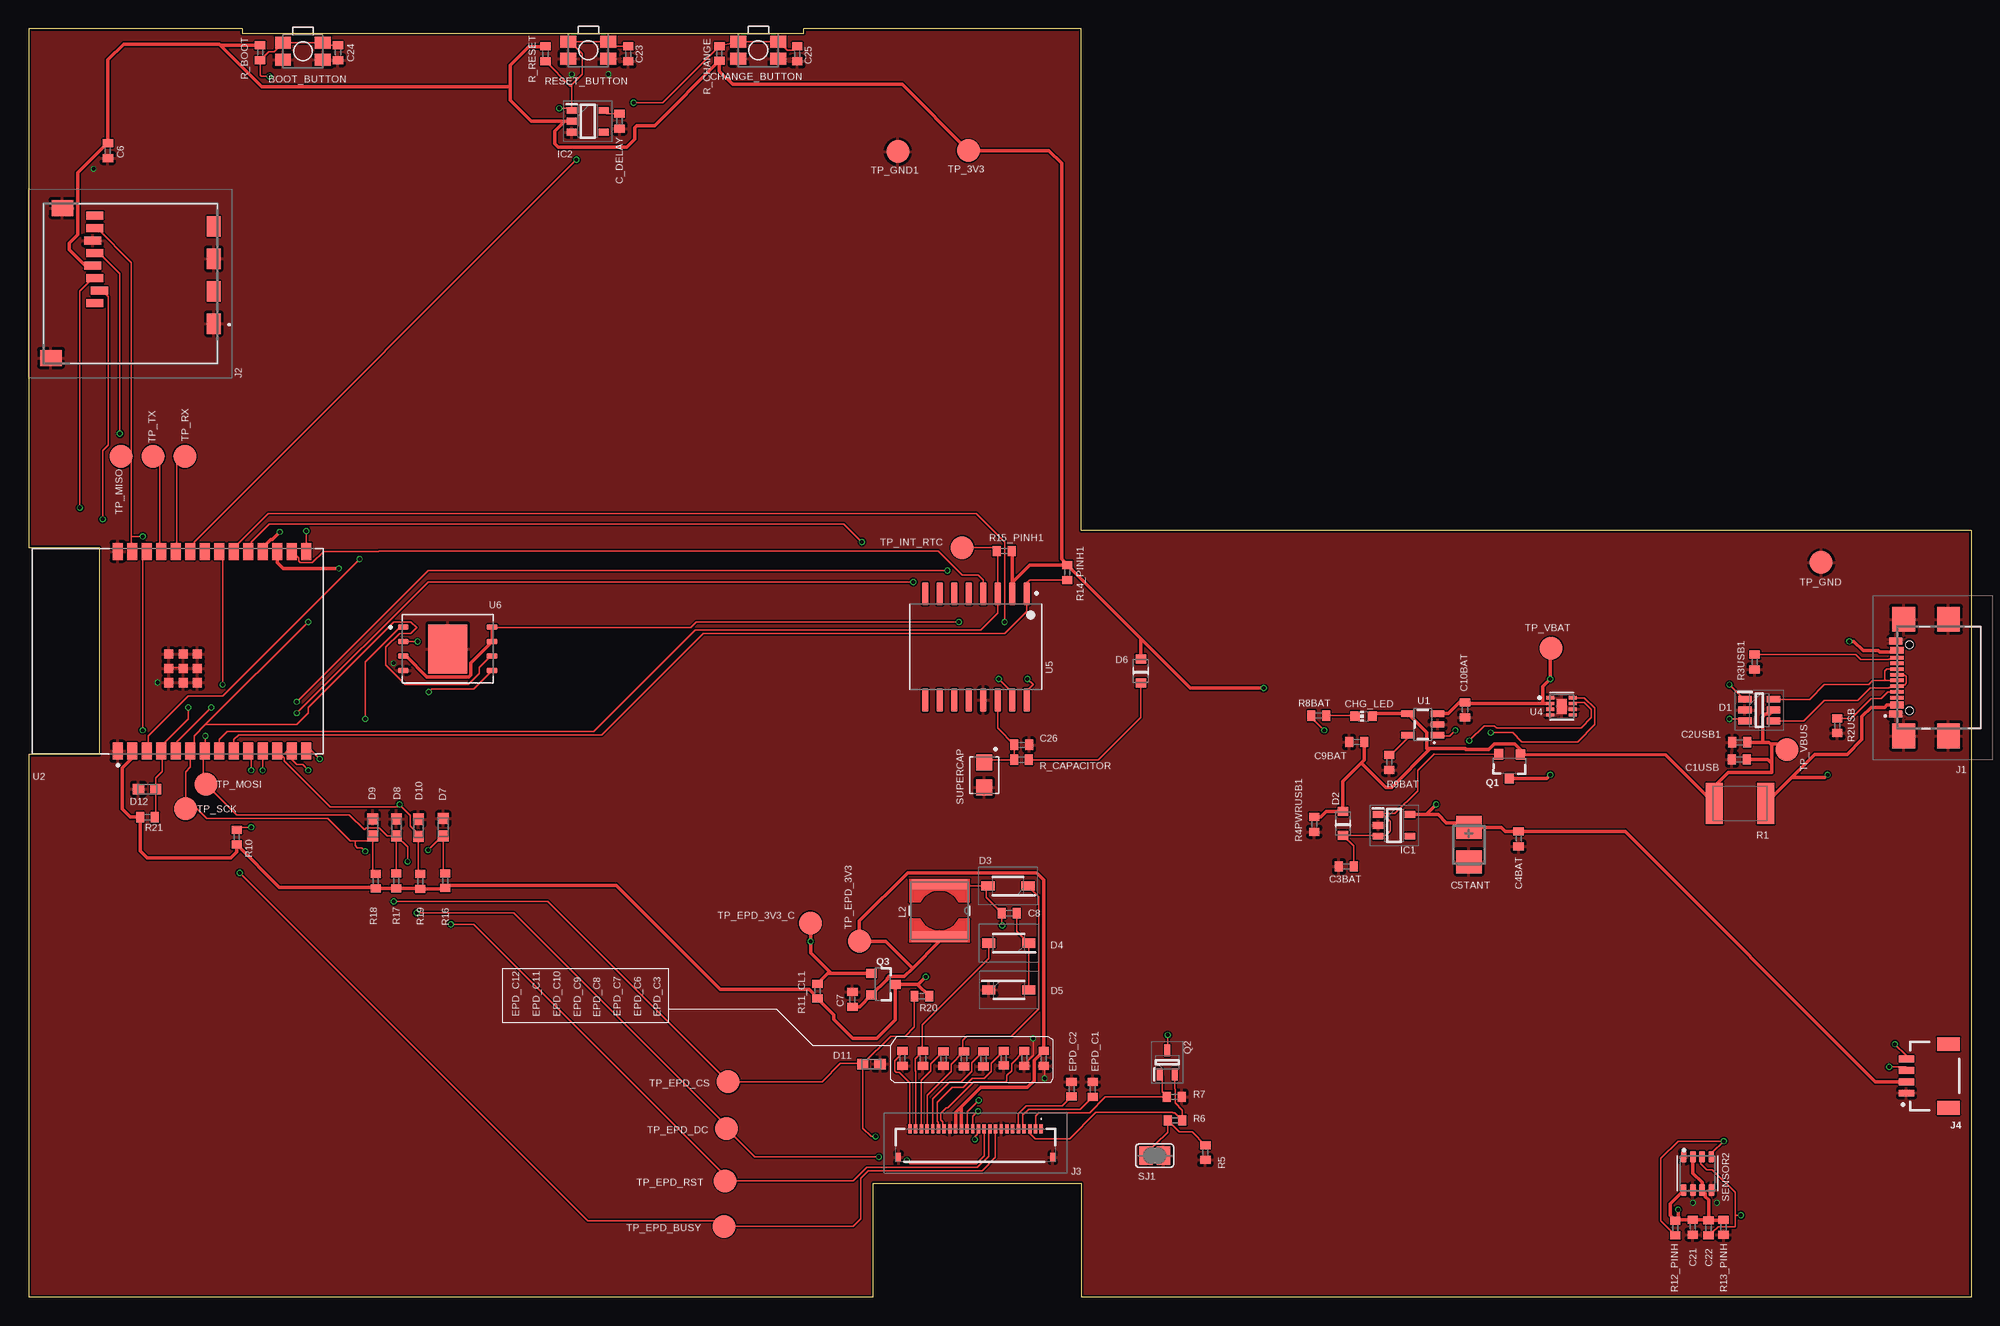
[diagram p1: board, top side]
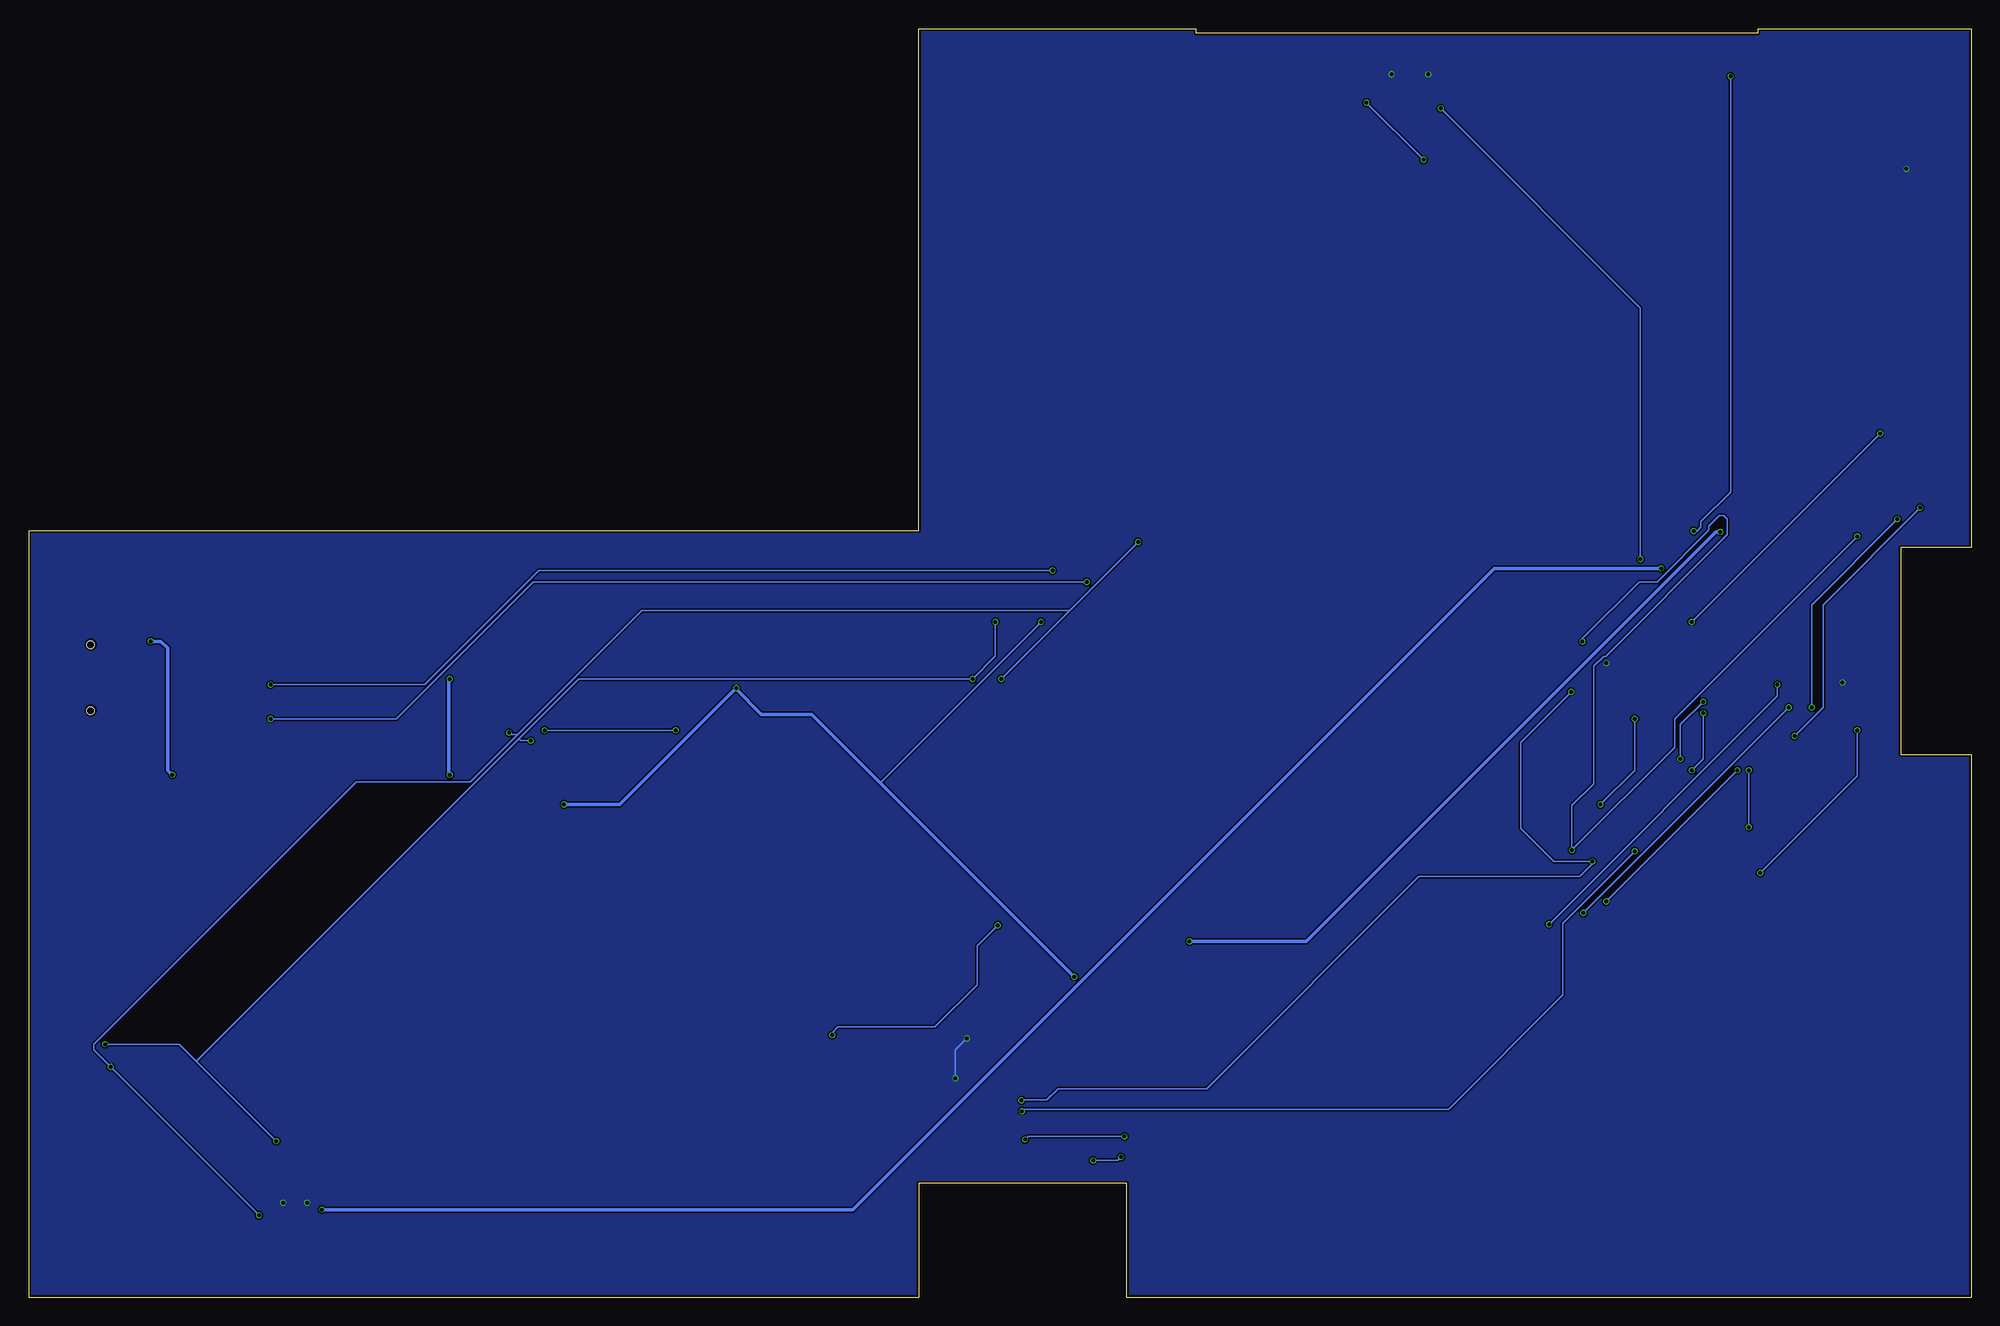
[diagram p2: board, bottom side, seen from below]

Size 170.2 x 111.2 mm. Coordinates in mm from the lower left corner, seen from the top.
Outline: 0,111.2 0,65.7 6.2,65.7 6.2,47.6 0,47.6 0,0 74,0 74,10 92.2,10 92.2,0 170.2,0 170.2,67.2 92.2,67.2 92.2,111.2 67.9,111.2 67.9,110.8 18.7,110.8 18.7,111.2 0,111.2
Copper layers (1*16): Top 0.035mm / dielectric 1.6mm / Bottom 0.035mm
Design rules "jlcpcb-2layers.dru *": minimum track width 0.15mm, minimum drill 0.3mm, track to track 5mil, track to pad 5mil, pad to pad 5mil, via to via 5mil, smd to smd 5mil, copper to edge 0.2mm, drill to drill 6mil, minimum pad ring 10mil, minimum via ring 3mil, stop-mask expansion 4mil, vias tented up to drill 0mil, thermal gap 10mil

### Footprints (pad centres in the part's own frame; a part is rotated, then mirrored left to right if it is on the bottom)
MYBUTTON = smd 1.4 x 1.05: 1 1.75,0.75; 2 -1.75,0.75; 3 -1.75,-0.75; 4 1.75,-0.75
ESP32_WROVER_EAGLE-LTSPICE_C0402 = smd 0.7 x 0.9: 1 -0.65,0; 2 0.65,0
RCL_CT3528 = smd 2 x 2.2: + -1.5,0; - 1.5,0
ADAFRUIT_CHIP-LED0603 = smd 0.8 x 0.8: A 0,-0.75; C 0,0.75
SOT95P280X145-6N = smd 1.2 x 0.6: 1 -1.25,0.95; 2 -1.25,0; 3 -1.25,-0.95; 4 1.25,-0.95; 5 1.25,0; 6 1.25,0.95
ESP32_WROVER_AVX---SD0805S020S1R0_AVX_SD0805S020S1R0_0 = smd 0.8 x 0.9: 1 -1.05,0; 2 1.05,0
SOD3716X135N = smd 1.15 x 0.8: 1 -1.75,0; 2 1.75,0
DIOC1608X36N = smd 0.97 x 0.94: 1 -0.75,0; 2 0.75,0
SOT95P280X120-5N = smd 0.9 x 0.6: 1 -1.4,0.95; 2 -1.4,0; 3 -1.4,-0.95; 4 1.4,-0.95; 5 1.4,0.95
SOT95P280X125-5N = smd 0.9 x 0.6: 1 -1.4,0.95; 2 -1.4,0; 3 -1.4,-0.95; 4 1.4,-0.95; 5 1.4,0.95
SAMACSYS_PARTS_USB4110GFA = smd 0.3 x 1.15: A1 -3.35,3.778; A4 -2.55,3.678; A5 -1.25,3.678; A6 -0.25,3.678; A7 0.25,3.678; A8 1.25,3.678; A9 2.55,3.678; A12 3.35,3.778; B1 3.05,3.778; B4 2.25,3.678; B5 1.75,3.678; B6 0.75,3.678; B7 -0.75,3.678; B8 -1.75,3.678; B9 -2.25,3.678; B12 -3.05,3.778 | smd 2.18 x 2: MP1 -5.11,-0.827; MP2 5.11,-0.827; MP3 -5.11,3.103; MP4 5.11,3.103 | hole 0.65: -2.89,2.603; 2.89,2.603
112ATAARR03ATTEND = smd 1.8 x 1.2: G1 10.6,10.4; G2 4.9,10.4; S1 7.75,10.4; S2 2.05,10.4 | smd 1.4 x 1.9: G3 13.6,-3.85; G4 0.45,-2.85 | smd 0.7 x 1.5: P1 8.8,0; P2 7.7,0.4; P3 6.6,0; P4 5.5,-0.2; P5 4.4,0; P6 3.3,-0.2; P7 2.2,0; P8 1.1,0
FH34SRJ24S05SH99 = smd 0.3 x 0.8: 1 5.75,1.45; 2 5.25,1.45; 3 4.75,1.45; 4 4.25,1.45; 5 3.75,1.45; 6 3.25,1.45; 7 2.75,1.45; 8 2.25,1.45; 9 1.75,1.45; 10 1.25,1.45; 11 0.75,1.45; 12 0.25,1.45; 13 -0.25,1.45; 14 -0.75,1.45; 15 -1.25,1.45; 16 -1.75,1.45; 17 -2.25,1.45; 18 -2.75,1.45; 19 -3.25,1.45; 20 -3.75,1.45; 21 -4.25,1.45; 22 -4.75,1.45; 23 -5.25,1.45; 24 -5.75,1.45 | smd 0.4 x 0.8: MP1 6.75,-1.05; MP2 -6.75,-1.05
JST04_1MM_RA = smd 0.6 x 1.35: 1 -1.5,0; 2 -0.5,0; 3 0.5,0; 4 1.5,0 | smd 1.2 x 2: NC1 2.8,-3.675; NC2 -2.8,-3.675
IND_4828-WE-TPC_WRE = smd 0.889 x 4.826: 1 -2.286,0; 2 2.286,0
ESP32_WROVER_SPARKFUN-DISCRETESEMI_SOT23-3 = smd 0.8 x 0.9: 1 -0.95,-1; 2 0.95,-1; 3 0,1.1
SOT65P210X110-3N = smd 1.05 x 0.5: 1 -1.05,0.65; 2 -1.05,-0.65; 3 1.05,0
ESP32C6_VARISTOR_CT/CN1812 = smd 1.5 x 3.6: 1 -2.25,0; 2 2.25,0
ESP32_WROVER_EAGLE-LTSPICE_R0402 = smd 0.7 x 0.9: 1 -0.65,0; 2 0.65,0
ESP32_WROVER_BME680_PSON80P300X300X100-8N = smd 1.016 x 0.5: 1 1.458,1.2; 2 1.458,0.4; 3 1.458,-0.4; 4 1.458,-1.2; 5 -1.458,-1.22; 6 -1.458,-0.4; 7 -1.458,0.4; 8 -1.458,1.2
SJ = smd 1.168 x 1.6: 1 -0.762,0; 2 0.762,0
CAPCP3225X100N = smd 1.4 x 1.4: 1 -1.1,0; 2 1.1,0
TP20R = smd 2 x 2: TP 0,0
ESP32_WROVER_SPARKFUN-IC-POWER_SOT23-5 = smd 0.55 x 1.2: 1 -0.95,-1.3; 2 0,-1.3; 3 0.95,-1.3; 4 0.95,1.3; 5 -0.95,1.3
XCVR_ESP32-C6-WROOM-1-N8 = smd 1.5 x 0.9: 1 -8.75,5.26; 2 -8.75,3.99; 3 -8.75,2.72; 4 -8.75,1.45; 5 -8.75,0.18; 6 -8.75,-1.09; 7 -8.75,-2.36; 8 -8.75,-3.63; 9 -8.75,-4.9; 10 -8.75,-6.17; 11 -8.75,-7.44; 12 -8.75,-8.71; 13 -8.75,-9.98; 14 -8.75,-11.25; 15 8.75,-11.25; 16 8.75,-9.98; 17 8.75,-8.71; 18 8.75,-7.44; 19 8.75,-6.17; 20 8.75,-4.9; 21 8.75,-3.63; 22 8.75,-2.36; 23 8.75,-1.09; 24 8.75,0.18; 25 8.75,1.45; 26 8.75,2.72; 27 8.75,3.99; 28 8.75,5.26 | smd 0.8 x 0.8: 29_1 -2.755,0.79; 29_2 -1.505,0.79; 29_3 -0.255,0.79; 29_4 -2.755,-0.46; 29_5 -1.505,-0.46; 29_6 -0.255,-0.46; 29_7 -2.755,-1.71; 29_8 -1.505,-1.71; 29_9 -0.255,-1.71
SON50P200X200X80-9N = smd 0.76 x 0.27: 1 -0.985,0.75; 2 -0.985,0.25; 3 -0.985,-0.25; 4 -0.985,-0.75; 5 0.985,-0.75; 6 0.985,-0.25; 7 0.985,0.25; 8 0.985,0.75 | smd 0.9 x 1.3: 9 0,0
SOIC127P1032X265-16N = smd 2.05 x 0.59: 1 -4.655,4.445; 2 -4.655,3.175; 3 -4.655,1.905; 4 -4.655,0.635; 5 -4.655,-0.635; 6 -4.655,-1.905; 7 -4.655,-3.175; 8 -4.655,-4.445; 9 4.655,-4.445; 10 4.655,-3.175; 11 4.655,-1.905; 12 4.655,-0.635; 13 4.655,0.635; 14 4.655,1.905; 15 4.655,3.175; 16 4.655,4.445
SON127P600X800X80-9N = smd 0.94 x 0.44: 1 -3.895,1.905; 2 -3.895,0.635; 3 -3.895,-0.635; 4 -3.895,-1.905; 5 3.895,-1.905; 6 3.895,-0.635; 7 3.895,0.635; 8 3.895,1.905 | smd 3.4 x 4.3: 9 0,0

### Placement (x,y rotation side)
BOOT_BUTTON  24.04,109.21 180 top
C1USB  149.87,47.15 180 top
C2USB1  149.89,48.65 180 top
C3BAT  115.44,37.77 180 top
C4BAT  130.53,40.19 270 top
C5TANT  126.18,39.68 270 top
C6  6.95,100.49 90 top
C7  72.17,26.11 90 top
C8  85.91,33.68 180 top
C9BAT  116.34,48.67 180 top
C10BAT  125.83,51.49 270 top
C21  145.79,6.16 270 top
C22  148.48,6.15 270 top
C23  52.53,108.98 270 top
C24  27.11,109.08 270 top
C25  67.33,108.98 270 top
C26  87.01,48.43 0 top
C_DELAY  51.77,103.08 270 top
CHANGE_BUTTON  63.93,109.31 180 top
CHG_LED  116.95,50.93 90 top
D1  151.61,51.47 0 top
D2  115.14,41.55 90 top
D3  85.8,36.05 180 top
D4  85.86,31.05 180 top
D5  85.88,26.95 0 top
D6  97.44,54.9 90 top
D7  36.33,41.21 90 top
D8  32.23,41.19 90 top
D9  30.15,41.18 90 top
D10  34.15,41.16 90 top
D11  73.84,20.45 0 top
D12  10.38,44.55 180 top
EPD_C1  93.22,18.25 270 top
EPD_C2  91.37,18.26 270 top
EPD_C3  88.93,20.94 90 top
EPD_C6  87.23,20.96 90 top
EPD_C7  85.43,20.97 90 top
EPD_C8  83.65,20.91 90 top
EPD_C9  81.95,20.92 90 top
EPD_C10  80.15,20.93 90 top
EPD_C11  78.35,20.94 90 top
EPD_C12  76.55,20.95 90 top
IC1  119.62,41.37 0 top
IC2  48.98,103.07 0 top
J1  167.36,54.32 90 top
J2  5.82,95.92 270 top
J3  82.96,13.32 0 top
J4  164.51,19.41 90 top
L2  79.8,33.9 270 top
Q1  129.73,46.59 179.2 top
Q2  99.75,20.61 90 top
Q3  74.84,27.45 270 top
R1  149.93,43.29 180 top
R2USB  158.44,50.1 90 top
R3USB1  151.21,55.68 270 top
R4PWRUSB1  112.63,41.46 90 top
R5  103.09,12.7 90 top
R6  100.36,17.59 180 top
R7  100.43,15.53 0 top
R8BAT  113.02,50.99 180 top
R9BAT  119.19,46.89 90 top
R10  18.23,40.33 270 top
R11_CL1  69.11,26.84 270 top
R12_PINH  144.26,6.09 90 top
R13_PINH  147.17,6.1 90 top
R14_PINH1  90.99,63.54 90 top
R15_PINH1  85.46,65.41 0 top
R16  36.51,36.52 270 top
R17  32.21,36.5 270 top
R18  30.41,36.48 270 top
R19  34.31,36.46 270 top
R20  78.26,26.41 0 top
R21  10.42,42.09 180 top
R_BOOT  20.29,109.08 90 top
R_CAPACITOR  86.98,47.12 0 top
R_CHANGE  60.52,109.02 270 top
R_RESET  45.29,108.98 90 top
RESET_BUTTON  49.04,109.31 180 top
SENSOR2  146.2,10.87 90 top
SJ1  98.65,12.43 180 top
SUPERCAP  83.72,45.78 270 top
TP_3V3  82.33,100.51 180 top
TP_EPD_3V3  72.78,31.21 180 top
TP_EPD_3V3_C  68.48,32.81 180 top
TP_EPD_BUSY  60.94,6.23 180 top
TP_EPD_CS  61.28,18.91 180 top
TP_EPD_DC  61.13,14.81 180 top
TP_EPD_RST  61.03,10.21 180 top
TP_GND  157.03,64.41 180 top
TP_GND1  76.15,100.41 180 top
TP_INT_RTC  81.78,65.71 180 top
TP_MISO  8.11,73.71 180 top
TP_MOSI  15.54,44.99 180 top
TP_RX  13.69,73.71 180 top
TP_SCK  13.76,42.83 180 top
TP_TX  10.91,73.71 180 top
TP_VBAT  133.37,56.91 180 top
TP_VBUS  154.03,48.01 180 top
U1  122.13,50.21 90 top
U2  13.08,56.63 90 top
U4  134.3,51.8 0 top
U5  82.98,57.02 270 top
U6  36.72,56.84 0 top

### Tracks (layer width: path | path; a pad name or v marks a point on that pad's centre or on a via)
3V3  (via drill 0.35)
  Top 0.152: 9,47.2 9,47.7 U2.2 | 125.5,41.6 125.5,41.7 126,41.2 C5TANT.+ | v81.5,59.2 58.5,59.2 58,58.7 41,58.7 U6.8
  Top 0.3: C6.2 6.95,101.2 | 6.95,101.2 6.95,108.45 8.33,109.83 16.7,109.83 16.8,109.73 | R_RESET.2 45.29,109.6 43.8,109.6 42.2,108 42.2,106.1 | 42.2,106.1 42.2,104.9 44.03,103.07 IC2.2 46.97,103.07 46.1,102.2 46.1,101.1 46.4,100.8 52.4,100.8 53.1,101.5 53.1,102.5 53.3,102.7 54.86,102.7 R_CHANGE.2 60.52,107.48 61.7,106.3 76.54,106.3 TP_3V3.TP 89.39,100.51 90.49,99.41 90.49,64.69 R14_PINH1.2 | 122.42,42.32 123.48,42.32 124.2,41.6 125.5,41.6 | C5TANT.+ 129.02,41.18 129.36,40.84 C4BAT.1 139.86,40.84 161.79,18.91 J4.2 | 9,47.2 8.2,46.4 8.2,42.8 8.91,42.09 R21.2 9.77,39.13 10.4,38.5 17.7,38.5 18.23,39.03 R10.2 21.95,35.95 30.25,35.95 30.39,35.81 R18.2 32.19,35.83 R17.2 34.27,35.85 R19.2 36.45,35.81 R16.2 36.74,36.1 51.5,36.1 60.6,27 68.37,27 69.11,26.26 R11_CL1.2 70.52,24.78 70.52,24.38 72.2,22.7 74.3,22.7 75.94,24.34 Q3.3 77.87,27.45 | U6.3 33.08,56.2 34.9,54.39 38.55,54.39 38.72,54.56 38.72,55.58 U6.7 U6.8 | 6.95,101.2 4.3,98.55 4.3,93.12 3.57,92.39 3.57,91.83 4.98,90.42 J2.P4 | R14_PINH1.2 97.44,57.74 | 97.44,57.74 101.78,53.4 v108.2,53.4 | 122.42,42.32 v123.3,43.2 | 122.42,42.32 IC1.5 | 77.87,27.45 R20.2 | v78.6,28.1 77.95,27.45 77.87,27.45 | 97.44,57.74 D6.2 | R14_PINH1.2 87.69,64.19 86.16,62.66 | 16.8,109.73 20.43,106.1 42.2,106.1 | R_BOOT.2 16.8,109.73 | 86.16,62.66 U5.2 | R15_PINH1.2 86.16,65.36 86.16,62.66
  Bottom 0.152: 95.6,45.1 v81.5,59.2
  Bottom 0.3: v108.2,53.4 108.25,53.35 | 108.25,53.35 118.4,43.2 v123.3,43.2 | v78.6,28.1 95.6,45.1 101.6,51.1 106,51.1 108.25,53.35
32KHZ
  Top 0.152: R14_PINH1.1 87.69,62.89 87.4,62.6 87.4,61.7 U5.1 87.42,60.12 85.5,58.2 59.1,58.2 50.2,49.3 18.4,49.3 17.98,48.88 U2.9
DN
  Top 0.152: D1.4 155.52,50.52 157.3,52.3 160.23,52.3 161.33,53.39 162.96,53.39 163.01,53.45 163.56,53.45 J1.B7 163.8,53.69 164.35,53.69 164.5,53.84 164.5,54.4 164.33,54.57 J1.A7
DP
  Top 0.152: D1.6 156.02,52.42 157.3,53.7 161.2,53.7 161.57,54.07 162.7,54.07 | J1.A6 162.7,54.07 | 162.7,54.07 162.6,54.17 162.6,54.9 162.77,55.07 J1.B6
EPD_3V3
  Top 0.3: J3.16 81.21,16.21 81.71,16.71 | J3.15 81.71,16.71 | 81.71,16.71 83.4,18.4 87.5,18.4 88.1,19 88.1,20.76 EPD_C3.2 88.93,36.57 88.3,37.2 77,37.2 72.78,32.98 TP_EPD_3V3.TP 75.09,31.21 77.45,28.85 | L2.2 79.8,31.2 77.45,28.85 | C7.1 72.8,25.46 Q3.2 75.21,27.87 75.21,27.96 75.38,28.13 76.73,28.13 77.45,28.85
EPD_3V3_C  (via drill 0.35)
  Top 0.152: 20.52,65.63 U2.18
  Top 0.3: R11_CL1.1 70.02,28.4 70.3,28.4 | 70.3,28.4 Q3.1 | 70.3,28.4 68.5,30.2 v68.5,31.2 68.5,32.79 TP_EPD_3V3_C.TP | v22,67.09 21.34,66.43 21.21,66.43 20.52,65.74 20.52,65.63
  Bottom 0.3: v68.5,31.2 58.29,31.2 22.4,67.09 v22,67.09
EPD_BUSY  (via drill 0.35)
  Top 0.152: J3.9 84.7,12.27 83.53,11.09 73.55,11.09 72.91,10.45 72.91,6.91 72.23,6.23 TP_EPD_BUSY.TP 60.5,6.7 49,6.7 v18.5,37.2 | v10,49.7 10,65.2 U2.26
  Bottom 0.152: v10,49.7 10,45.7 v18.5,37.2
EPD_CS  (via drill 0.35)
  Top 0.152: D11.1 75.54,22.9 76.8,22.9 77.61,23.71 R20.1 | D11.1 73.04,20.5 71.1,20.5 69.51,18.91 TP_EPD_CS.TP 61,19.2 45.5,34.7 v32,34.7 | v20.5,46.2 20.5,47.7 U2.11 | D11.1 73.09,14.81 73.8,14.1 v74.2,14.1 | J3.12 83.09,14.65 83.09,14.27 82.9,14.09 v82.9,13.84
  Bottom 0.152: v32,34.7 v20.5,46.2 | v74.2,14.1 82.64,14.1 v82.9,13.84
EPD_DC  (via drill 0.35)
  Top 0.152: J3.11 83.71,12.41 83,11.7 77.24,11.7 v76.94,12 | v74.5,12.3 63.63,12.3 TP_EPD_DC.TP 61,15.2 42.5,33.7 v34,33.7 | v16,51.7 13,48.7 13,48.2 U2.5
  Bottom 0.152: v16,51.7 v34,33.7 | v74.5,12.3 74.8,12 v76.94,12
EPD_RST  (via drill 0.35)
  Top 0.152: J3.10 84.12,14.68 84.12,12.39 83.13,11.4 73.42,11.4 72.23,10.21 TP_EPD_RST.TP 61,10.7 39,32.7 v37,32.7 | v17,53.7 17,65.2 U2.21
  Bottom 0.152: v17,53.7 17,52.7 v37,32.7
FLASH_CS  (via drill 0.35)
  Top 0.152: U2.12 22.38,47.29 22.38,47.03 26.42,43 32.7,43 | 32.7,43 33,42.7 33.45,42.25 33.45,41.33 34.02,40.76 34.02,40.28 D10.1 34.15,37.27 R19.1 | v29.5,50.7 29.5,55.7 32.5,58.7 U6.1 | 32.7,43 v32.5,43.2
  Bottom 0.152: v29.5,50.7 29.5,46.2 v32.5,43.2
GDR
  Top 0.152: Q2.1 99.3,19.36 99.3,18 R6.2 94.34,17.59 92.94,16.2 88.5,16.2 88.21,15.91 J3.2
GND  (via drill 0.35)
  Top 0.152: U2.29_5 13.5,55.2 12.5,55.2 U2.29_2 | v89,19.2 89,20.2 EPD_C3.1 | v88,22.7 88,21.2 87,20.2 EPD_C6.1
  Top 0.3: J1.A1 163.61,50.9
  Bottom 0.152: v89,19.2 89,21.7 v88,22.7
  other vias: 145.8,8.3 50.8,107.2 31.98,55.58 11.3,53.9 147.9,8.3 5.7,98.9 47.58,107.18
  pour Top: 92.36,10.14 92.38,10.12 92.38,0.18 170.02,0.18 170.02,67.02 92.08,67.02 92.06,67.04 92.04,67.06 92.02,67.08 92.02,111.02 68.08,111.02 68.08,110.68 68.06,110.66 68.04,110.64 68.02,110.62 18.58,110.62 18.56,110.64 18.54,110.66 18.52,110.68 18.52,111.02 0.18,111.02 0.18,65.88 6.32,65.88 6.34,65.86 6.36,65.84 6.38,65.82 6.38,47.48 6.36,47.46 6.34,47.44 6.32,47.42 0.18,47.42 0.18,0.18 73.82,0.18 73.82,10.12 73.84,10.14 73.86,10.16 73.88,10.18 92.32,10.18 92.34,10.16
  pour Bottom: 92.36,10.14 92.38,10.12 92.38,0.18 170.02,0.18 170.02,67.02 92.08,67.02 92.06,67.04 92.04,67.06 92.02,67.08 92.02,111.02 68.08,111.02 68.08,110.68 68.06,110.66 68.04,110.64 68.02,110.62 18.58,110.62 18.56,110.64 18.54,110.66 18.52,110.68 18.52,111.02 0.18,111.02 0.18,65.88 6.32,65.88 6.34,65.86 6.36,65.84 6.38,65.82 6.38,47.48 6.36,47.46 6.34,47.44 6.32,47.42 0.18,47.42 0.18,0.18 73.82,0.18 73.82,10.12 73.84,10.14 73.86,10.16 73.88,10.18 92.32,10.18 92.34,10.16
GPIO8  (via drill 0.35)
  Top 0.152: v19.5,41.2 18.5,41.2 R10.1 | v19.5,46.2 19.5,47.7 U2.10
  Bottom 0.152: v19.5,46.2 v19.5,41.2
I2C_PW  (via drill 0.35)
  Top 0.3: SENSOR2.2 145.8,10.9 146.6,10.1 SENSOR2.6 146.89,9.12 146.89,8.83 147.17,8.55 R13_PINH.2 | R12_PINH.2 143.8,7.2 143.8,8.21 SENSOR2.8 | R12_PINH.2 144.33,6.81 C21.1 147.11,6.81 R13_PINH.2 | R12_PINH.2 144.5,6.98 v144.5,7.7 | v27.19,63.89 22.31,63.89 21.79,64.41 U2.17 | R13_PINH.2 148.43,6.75 C22.1
  Bottom 0.3: v27.19,63.89 41.81,63.89 98,7.7 v144.5,7.7
INT_RTC
  Top 0.152: U2.8 16.71,48.91 17.41,49.61 49.51,49.61 58.41,58.5 83.41,58.5 84.9,60 84.9,61.66 U5.3 84.89,65.33 R15_PINH1.1 84.51,65.71 TP_INT_RTC.TP
IO/BOOT  (via drill 0.35)
  Top 0.152: C24.1 26.02,109.73 BOOT_BUTTON.3 BOOT_BUTTON.4 21.52,109.19 21.04,109.19 R_BOOT.1 20.29,107.11 20.4,107 v21.1,107 | U2.15 v24.33,67.16
  Bottom 0.152: v21.1,107 21.1,70.6 23.7,68 23.7,67.49 24.03,67.16 v24.33,67.16
IO/CHANGE  (via drill 0.35)
  Top 0.152: v48,99.7 14.5,66.2 14.5,65.7 U2.23 | C25.1 66.98,109.29 66.45,109.29 CHANGE_BUTTON.3 CHANGE_BUTTON.4 60.6,109.7 60.52,109.7 R_CHANGE.1 55.56,104.7 v53,104.7
  Bottom 0.152: v53,104.7 v48,99.7
MISO  (via drill 0.35)
  Top 0.152: R16.1 36.33,37.35 D7.1 36,40.2 v35,39.2 | 9,73.2 9,66.7 | 9,66.7 9,65.7 U2.27 | 9,73.2 8.5,73.7 TP_MISO.TP | 9,73.2 9,90.7 6,93.7 J2.P7 | 9,66.7 v10,66.7 | U6.2 v34.08,57.47
  Bottom 0.152: v10,66.7 26,50.7 26,48.2 v35,39.2 35,43.1 33.1,45 33.1,55.32 32.23,56.19 32.05,56.19 21.39,66.84 21.39,68.19 21.7,68.5 22.1,68.5 23,67.6 23,67.23 27.53,62.7 29.1,62.7 34.08,57.72 v34.08,57.47
MOSI  (via drill 0.35)
  Top 0.152: R17.1 32.23,37.17 D8.1 | D8.1 31.42,40.44 30.71,41.14 29.59,41.14 29.44,41 29.4,41 28.1,42.3 18.23,42.3 TP_MOSI.TP 15.3,45.23 15.3,47.74 U2.7 15.5,48.2 v15.5,49.2 | v4.5,69.2 4.5,88.2 5.5,89.2 J2.P3 | D8.1 33.2,39.47 v33.2,38.2 | U6.5 38.98,53.3 35.3,53.3 v35.06,53.06 | v83.23,17.27 82.21,16.25 J3.14
  Bottom 0.152: v4.5,69.2 13,60.7 13,51.7 v15.5,49.2 | v35.06,53.06 39.5,48.63 39.5,41.1 36.6,38.2 v33.2,38.2 33.2,38 34.3,36.9 48.4,36.9 67,18.3 80,18.3 81,17.3 83.2,17.3 v83.23,17.27
N$1
  Top 0.152: R2USB.2 159.65,50.75 161.4,52.5 162.3,52.5 162.87,53.07 J1.A5
N$2
  Top 0.152: EPD_C6.2 86.11,20.49 86.11,19.88 85.7,19.47 85.7,19 85.6,18.9 82.8,18.9 80.51,16.61 80.39,16.61 79.92,16.14 79.92,15.55 80.09,15.38 80.09,14.89 J3.18
N$3
  Top 0.152: EPD_C1.2 92.12,16.5 87.6,16.5 87.1,16 87.1,14.88 J3.4
N$4
  Top 0.152: Q1.2 123.13,47.63 121.7,46.2 121.7,44.4 119.7,42.4 118.3,42.4 IC1.1 118.68,42.32 119.3,41.7 119.3,40.9 118.9,40.5 118.3,40.5 IC1.3 118.14,40.5 D2.1 116.09,39.55 C3BAT.1
N$5
  Top 0.152: D5.2 87.63,31.03 D4.1 86.56,32.1 C8.1
N$6  (via drill 0.35)
  Top 0.152: v113.5,49.7 112.5,50.7 R8BAT.2 | v125,49.7 124.5,49.2 123.5,49.2 U1.1
  Bottom 0.152: v125,49.7 v113.5,49.7
N$7
  Top 0.152: R8BAT.1 116.14,50.99 CHG_LED.C
N$8
  Top 0.152: R9BAT.2 119.5,47.7 121,49.2 U1.5
N$9
  Top 0.152: J3.5 86.71,16.11 87.41,16.8 90.56,16.8 EPD_C2.2
N$10
  Top 0.152: R3USB1.1 160.07,56.33 160.5,55.9 162.96,55.9 163.01,55.95 163.56,55.95 J1.B5
N$11
  Top 0.152: EPD_C7.2 84.33,20.52 84.33,19.81 83.72,19.2 82.67,19.2 81.87,18.4 80.9,18.4 79.62,17.12 79.62,15.42 79.71,15.33 J3.19
N$12
  Top 0.152: EPD_C8.2 82.63,20.54 82.63,19.82 81.7,18.9 80.7,18.9 79.21,17.41 J3.20
N$13
  Top 0.152: C_DELAY.1 50.67,103.73 IC2.5
N$14
  Top 0.152: EPD_C10.2 79.03,20.46 79.03,19.84 78.21,19.03 J3.22
N$15
  Top 0.152: D6.1 97.44,50.84 93.72,47.12 R_CAPACITOR.2
N$16
  Top 0.152: EPD_C12.2 76.55,21.42 75.87,20.74 75.87,19.85 76,19.72 76.28,19.72 77.21,18.79 J3.24
PREVGH
  Top 0.152: EPD_C9.2 81.84,21.46 | 81.84,21.46 80.83,20.45 80.83,19.84 78.71,17.72 J3.21 | D3.1 88.5,35.1 88.5,25.3 86.1,22.9 82.2,22.9 81.84,22.54 81.84,21.46
PREVGL
  Top 0.152: J3.23 77.71,19.81 77.67,19.84 77.67,20.91 EPD_C11.2 78.3,21.64 78.3,23.9 84.11,29.71 D4.2
RESE
  Top 0.152: Q2.2 100.4,18.3 100.43,18.27 100.43,17.04 101.08,16.4 R7.2 100.41,16.2 100.23,16.2 100.22,16.21 93.51,16.21 91.2,13.9 88.2,13.9 87.71,14.39 J3.3
RESE'
  Top 0.152: SJ1.2 97.89,12.61 98.73,13.46 98.76,13.46 99.78,14.48 R7.1 100.81,14.5 101.94,14.5 R5.2
RESET  (via drill 0.35)
  Top 0.152: 47.58,106.28 IC2.1 47.5,104.2 v46.5,104.2 | v29,64.7 17,52.7 14,52.7 10.5,49.2 10.5,48.2 U2.3 | 47.58,106.28 47.71,106.41 48.5,107.2 48.5,109 47.44,110.06 RESET_BUTTON.4 RESET_BUTTON.3 51.22,109.63 C23.1 | R_RESET.1 47.46,106.16 47.58,106.28
  Bottom 0.152: v29,64.7 29,86.7 v46.5,104.2
RTC_RST
  Top 0.152: U2.16 23.65,64.79 23.65,64.53 23.79,64.4 24.88,64.4 25.85,65.38 30.68,65.38 30.7,65.4 79.7,65.4 81.8,63.3 83.2,63.3 83.61,62.89 U5.4
RX
  Top 0.152: U2.24 13,65.7 13,73.2 13.5,73.7 TP_RX.TP
SCK  (via drill 0.35)
  Top 0.152: 28.6,40 29.72,40 D9.1 30.15,37.39 R18.1 | 15.5,50.2 23.5,50.2 24.5,51.2 24.5,51.7 32,59.2 33.5,59.2 34,58.7 33.5,58.2 32.5,58.2 31.29,56.99 31.29,55.41 32.99,53.71 38.51,53.71 39.5,54.7 39.5,55.2 40.5,56.2 U6.6 | 15.5,50.2 14.5,49.2 14.5,48.2 U2.6 14.17,46.47 13.76,46.06 TP_SCK.TP 14.77,42.83 15.61,42 26.2,42 28.2,40 28.6,40 | v8,75.7 8,89.7 6.5,91.2 6,91.2 J2.P5 | 15.5,50.2 v24.5,59.2 | v83.18,16.32 82.71,15.85 J3.13 | v29.5,39.1 29.2,39.4 28.8,39.4 28.6,39.6 28.6,40
  Bottom 0.152: v24.5,59.2 v8,75.7 | v29.5,39.1 35.8,32.8 35.8,26.5 45.8,16.5 83,16.5 v83.18,16.32
SCL  (via drill 0.35)
  Top 0.152: R12_PINH.1 144,5.7 143,6.7 143,12.2 144.5,13.7 v148.5,13.7 147.5,12.7 SENSOR2.4 | v163.5,22.2 164.5,21.2 J4.4 | v85.5,59.2 85.5,66.2 83,68.7 21,68.7 18,65.7 U2.20 | v87.5,54.2 88,53.7 87.5,53.2 87.5,52.7 U5.16 | U4.7 135.38,52.15 136.27,52.15 136.91,51.51 136.91,50.81 136,49.9 128.6,49.9 128.4,50.1 127.5,50.1 v126.2,48.8
  Bottom 0.152: v163.5,22.2 157,22.2 155.5,20.7 | v148.5,13.7 155.5,20.7 | v85.5,59.2 85.5,56.2 v87.5,54.2 122,54.2 127.25,48.95 | 127.25,48.95 155.5,20.7 | 127.25,48.95 127.1,48.8 v126.2,48.8
SDA  (via drill 0.35)
  Top 0.152: 149.5,7.2 149.5,9.2 147.5,11.2 147,11.2 146.5,11.7 146.5,12.2 SENSOR2.3 | 149.5,7.2 149.5,6.2 148,6.2 147.5,5.7 R13_PINH.1 | v163,20.2 164.5,20.2 J4.3 | 149.5,7.2 v150,7.2 | v85,54.2 86,53.2 86,52.7 U5.15 | U2.19 19.5,65.7 19.5,66.2 21.07,67.77 71.43,67.77 v73,66.2 | v128.1,49.49 130.01,49.49 130.8,48.7 135.7,48.7 137.21,50.21 137.21,51.64 136.3,52.55 U4.8
  Bottom 0.152: v150,7.2 v163,20.2 164.5,21.7 164.5,22.2 141.51,45.19 131.51,45.19 127.35,49.35 | v85,54.2 79,60.2 | 79,60.2 v73,66.2 | 127.35,49.35 116.5,60.2 79,60.2 | 127.35,49.35 127.95,49.35 v128.09,49.49 v128.1,49.49
SRC  (via drill 0.35)
  Top 0.152: v85.3,32.6 85.26,32.64 C8.2 83.9,35.04 83.9,35.5 83.9,35.9 D3.2 79.94,36.05 L2.1 | v99.8,23 99.8,21.71 Q2.3
  Bottom 0.152: v85.3,32.6 87.1,30.8 87.1,27.4 90.8,23.7 99.3,23.7 99.8,23.2 v99.8,23
SS_SD  (via drill 0.35)
  Top 0.152: R21.1 11.13,42.15 D12.1 11.13,45.53 11.7,46.1 11.7,47.81 U2.4 11.5,48.2 14,50.7 v14,51.7 | v6.5,68.2 6.5,74.2 7,74.7 7,87.7 6.5,88.2 J2.P2
  Bottom 0.152: v6.5,68.2 14,60.7 v14,51.7
TX
  Top 0.152: U2.25 11.5,65.7 11.5,73.2 11,73.7 TP_TX.TP
USB_D+  (via drill 0.35)
  Top 0.152: v149,53.7 150,52.7 D1.1 | v80.5,63.7 35,63.7 v23.5,52.2 | v25.5,47.2 24.5,48.2 U2.14
  Bottom 0.152: v149,53.7 135.5,53.7 125.5,63.7 v80.5,63.7 | v23.5,52.2 25.5,50.2 v25.5,47.2
USB_D-  (via drill 0.35)
  Top 0.152: v149,50.7 150,50.7 D1.3 | v77.5,62.7 35,62.7 v23.5,51.2 | v24.5,46.2 24,46.7 23.5,46.7 22.5,47.7 23,48.2 U2.13
  Bottom 0.152: v149,50.7 138,50.7 126,62.7 v77.5,62.7 | v23.5,51.2 23.5,47.2 v24.5,46.2
VBAT  (via drill 0.35)
  Top 0.3: U1.3 124.36,51.16 125.34,52.14 C10BAT.1 125.92,52.05 132.6,52.05 | U4.3 U4.2 132.6,52.05 | v133.3,45.8 132.99,45.49 Q1.3 | 132.6,52.05 132.63,52.08 132.63,53.53 v133.3,54.2 133.3,56.84 TP_VBAT.TP
  Bottom 0.3: v133.3,45.8 133.4,45.9 133.4,54.1 v133.3,54.2
VBUS
  Top 0.3: R4PWRUSB1.2 113.21,42.11 113.7,42.6 D2.2 115.14,45.24 116.75,46.85 | 116.75,46.85 117,47.1 C9BAT.1 | CHG_LED.A 117.93,51.16 U1.4 122.5,49.49 122.5,48.1 122.8,48.1 | 152.7,46.8 152.7,46 148.9,46 147.68,44.78 R1.2 143.41,47.55 Q1.1 130.72,47.98 130.2,48.5 128.41,48.5 127.93,48.02 125.92,48.02 125.84,48.1 122.8,48.1 | 152.7,46.8 152.35,47.15 C1USB.1 | C2USB1.1 151.9,48.65 | 151.9,48.65 152.45,48.65 152.6,48.5 | 152.6,48.5 152.7,48.4 152.7,46.8 | 116.75,46.85 118.9,44.7 119.4,44.7 122.8,48.1 | D1.5 152.51,51.12 152.13,51.12 151.9,50.89 151.9,48.65 | TP_VBUS.TP 153.54,48.5 152.6,48.5
VRTC
  Top 0.152: SUPERCAP.1 83.96,47.12 R_CAPACITOR.1 86.33,48.4 C26.1 84.89,49.91 U5.14
VUSB  (via drill 0.35)
  Top 0.3: R1.1 154.45,45.55 | 154.45,45.55 156.49,47.6 159.3,47.6 160.6,48.9 160.6,50.9 161.42,51.72 162.62,51.72 162.8,51.9 163.51,51.9 J1.B9 J1.A4 | 154.45,45.55 157.35,45.55 v157.6,45.8 | v159.5,57.5 159.9,57.5 160.7,56.7 162.05,56.7 162.18,56.57 J1.B4 J1.A9
  Bottom 0.3: v157.6,45.8 158,46.2 158,56.9 158.6,57.5 v159.5,57.5